# EAGLE design Zigbee Tracker v2 (EAGLE 9.5.0)
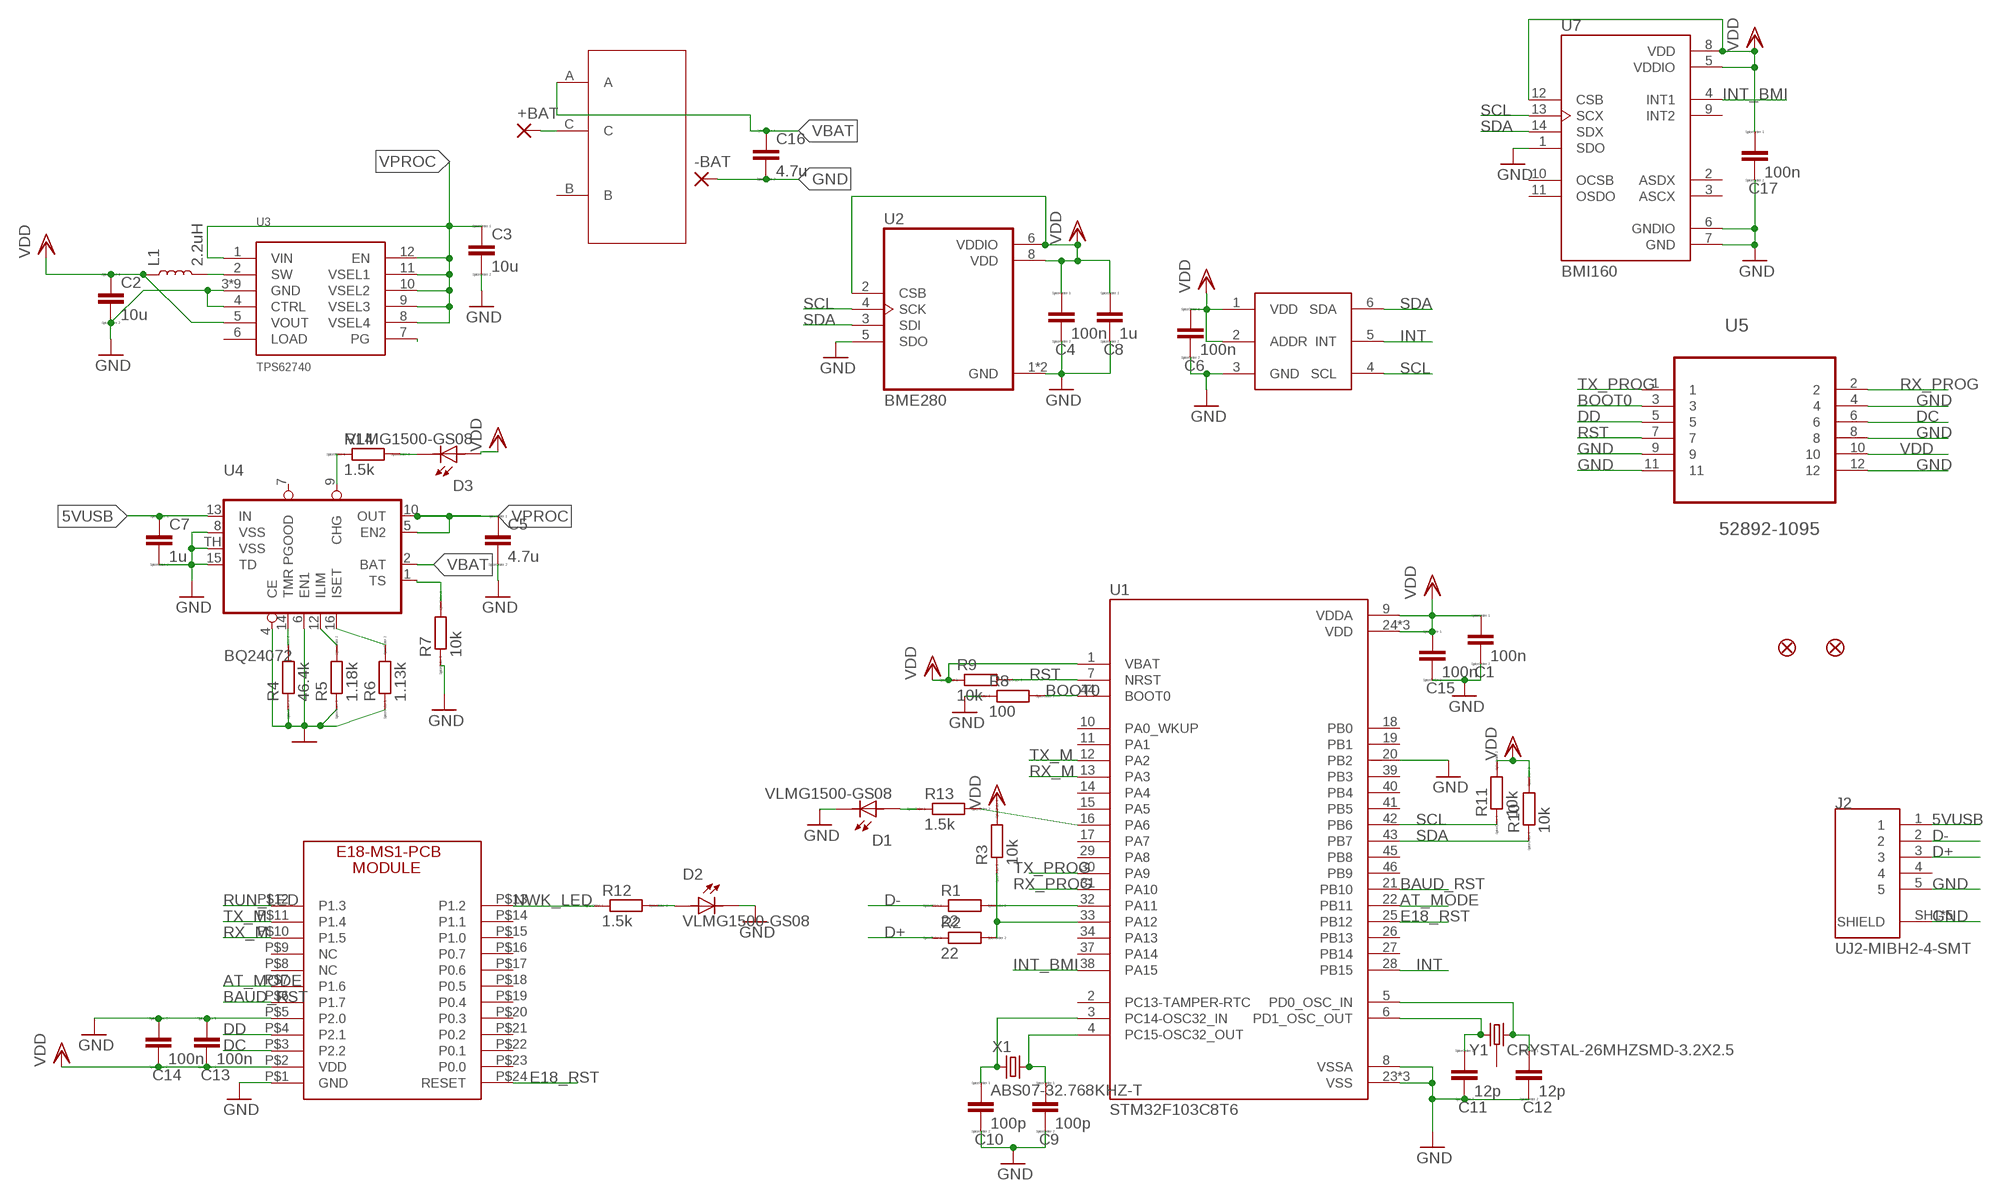
[diagram p0: schematic, sheet 1]

## Parts
+BAT  1,6/0,8  [1,6/0,8]
-BAT  1,6/0,8  [1,6/0,8]
C1  100n  CC0402  [C0402]
C2  10u  CC0402  [C0402]
C3  10u  CC0402  [C0402]
C4  100n  CC0402  [C0402]
C5  4.7u  CC0402  [C0402]
C6  100n  CC0402  [C0402]
C7  1u  CC0402  [C0402]
C8  1u  CC0402  [C0402]
C9  100p  CC0402  [C0402]
C10  100p  CC0402  [C0402]
C11  12p  CC0402  [C0402]
C12  12p  CC0402  [C0402]
C13  100n  CC0402  [C0402]
C14  100n  CC0402  [C0402]
C15  100n  CC0402  [C0402]
C16  4.7u  CC0402  [C0402]
C17  100n  CC0402  [C0402]
D1  VLMG1500-GS08  [LEDC1005X35N]
D2  VLMG1500-GS08  [LEDC1005X35N]
D3  VLMG1500-GS08  [LEDC1005X35N]
FD1  FIDUCIALUFIDUCIAL  [FIDUCIAL-MICRO]
FD2  FIDUCIALUFIDUCIAL  [FIDUCIAL-MICRO]
J2  UJ2-MIBH2-4-SMT  [CUI_UJ2-MIBH2-4-SMT]
L1  2.2uH  INDUCTOR-0805-3.3UH  [0805]
R1  22  RR0402  [R0402]
R2  22  RR0402  [R0402]
R3  10k  RR0402  [R0402]
R4  46.4k  RR0402  [R0402]
R5  1.18k  RR0402  [R0402]
R6  1.13k  RR0402  [R0402]
R7  10k  RR0402  [R0402]
R8  100  RR0402  [R0402]
R9  10k  RR0402  [R0402]
R10  10k  RR0402  [R0402]
R11  10k  RR0402  [R0402]
R12  1.5k  RR0402  [R0402]
R13  1.5k  RR0402  [R0402]
R14  1.5k  RR0402  [R0402]
U1  STM32F103C8T6  [QFP50P900X900X160-48N]
U2  BME280  [PSON65P250X250X100-8N]
U3  TPS62740  [DSS]
U4  BQ24072  [S-PVQFN-N16]
U5  52892-1095  [MOLEX_52892-1095]
U7  BMI160  [PQFN50P300X250X88-14N]
U$1  E18  [E18-MS1-PCB]
U$2  TI-OPT3001  [TI-OPT3001]
U$3  SMDTOGGLESWITCH  [SMDTOGGLESWITCH]
X1  ABS07-32.768KHZ-T  [ABS07-32.768KHZ-T]
Y1  CRYSTAL-26MHZSMD-3.2X2.5  [CRYSTAL-SMD-3.2X2.5MM]

## Nets
5VUSB [PWRINFL]: C7.1 J2.1 U4.13(IN)
AT_MODE: U1.22(PB11) U$1.P$7(P1.6)
BAUD_RST: U1.21(PB10) U$1.P$6(P1.7)
BOOT0: R8.2 U1.44(BOOT0) U5.3
D+: J2.3 R2.1
D-: J2.2 R1.1
DC: U5.6 U$1.P$3(P2.2)
DD: U5.5 U$1.P$4(P2.1)
E18_RST: U1.25(PB12) U$1.P$24(RESET)
GND: -BAT.1(P) C1.2 C2.2 C3.2 C4.2 C5.2 C6.2 C7.2 C8.2 C9.2 C10.2 C11.2 C12.2 C13.1 C14.1 C15.2 C16.2 C17.2 D1.2 D2.2 J2.5 J2.SH1(SHIELD) J2.SH2(SHIELD) J2.SH3(SHIELD) J2.SH4(SHIELD) J2.SH5(SHIELD) R4.1 R5.1 R6.1 R7.1 R8.1 U1.8(VSSA) U1.20(PB2) U1.23(VSS) U1.35(VSS) U1.47(VSS) U2.1(GND) U2.5(SDO) U2.7(GND) U3.3(GND) U3.4(CTRL) U3.13(GND) U3.14(GND) U3.15(GND) U3.16(GND) U3.18(GND) U3.19(GND) U3.20(GND) U3.P$18(GND) U4.4(CE) U4.6(EN1) U4.8(VSS) U4.15(TD) U4.TH(VSS) U5.4 U5.8 U5.9 U5.11 U5.12 U7.1(SDO) U7.6(GNDIO) U7.7(GND) U$1.P$1(GND) U$1.P$5(P2.0) U$2.3(GND)
INT: U1.28(PB15) U$2.5(INT)
INT_BMI: U1.38(PA15) U7.4(INT1)
N$1: R1.2 U1.32(PA11)
N$2: R2.2 R3.1 U1.33(PA12)
N$3: C10.1 U1.3(PC14-OSC32_IN) X1.1
N$4: C9.1 U1.4(PC15-OSC32_OUT) X1.2
N$5: C12.1 U1.5(PD0_OSC_IN) Y1.3
N$6: L1.2 U3.2(SW)
N$7: C11.1 U1.6(PD1_OSC_OUT) Y1.1
N$8: R4.2 U4.14(TMR)
N$9: R5.2 U4.12(ILIM)
N$10: +BAT.1(P) U$3.C
N$11: D2.1 R12.2
N$12: R6.2 U4.16(ISET)
N$13: R13.2 U1.16(PA6)
N$14: D1.1 R13.1
N$15: D3.2 R14.2
N$16: R14.1 U4.9(CHG)
NWK_LED: R12.1 U$1.P$13(P1.2)
PG_SMR: U3.7(PG)
RST: R9.2 U1.7(NRST) U5.7
RUN_LED: U$1.P$12(P1.3)
RX_M: U1.13(PA3) U$1.P$10(P1.5)
RX_PROG: U1.31(PA10) U5.2
SCL: R11.1 U1.42(PB6) U2.4(SCK) U7.13(SCX) U$2.4(SCL)
SDA: R10.1 U1.43(PB7) U2.3(SDI) U7.14(SDX) U$2.6(SDA)
TS: R7.2 U4.1(TS)
TX_M: U1.12(PA2) U$1.P$11(P1.4)
TX_PROG: U1.30(PA9) U5.1
VBAT [PWRINFL]: C16.1 U4.2(BAT) U$3.A
VDD: C1.1 C2.1 C4.1 C6.1 C8.1 C13.2 C14.2 C15.1 C17.1 D3.1 L1.1 R3.2 R9.1 R10.2 R11.2 U1.1(VBAT) U1.9(VDDA) U1.24(VDD) U1.36(VDD) U1.48(VDD) U2.2(CSB) U2.6(VDDIO) U2.8(VDD) U3.5(VOUT) U5.10 U7.5(VDDIO) U7.8(VDD) U7.12(CSB) U$1.P$2(VDD) U$2.1(VDD) U$2.2(ADDR)
VPROC [NCLS3V7]: C3.1 C5.1 U3.1(VIN) U3.8(VSEL4) U3.9(VSEL3) U3.10(VSEL2) U3.11(VSEL1) U3.12(EN) U4.5(EN2) U4.10(OUT)
Unconnected: J2.4 U1.2(PC13-TAMPER-RTC) U1.10(PA0_WKUP) U1.11(PA1) U1.14(PA4) U1.15(PA5) U1.17(PA7) U1.18(PB0) U1.19(PB1) U1.26(PB13) U1.27(PB14) U1.29(PA8) U1.34(PA13) U1.37(PA14) U1.39(PB3) U1.40(PB4) U1.41(PB5) U1.45(PB8) U1.46(PB9) U3.6(LOAD) U4.7(PGOOD) U7.2(ASDX) U7.3(ASCX) U7.9(INT2) U7.10(OCSB) U7.11(OSDO) U$1.P$8(NC) U$1.P$9(NC) U$1.P$14(P1.1) U$1.P$15(P1.0) U$1.P$16(P0.7) U$1.P$17(P0.6) U$1.P$18(P0.5) U$1.P$19(P0.4) U$1.P$20(P0.3) U$1.P$21(P0.2) U$1.P$22(P0.1) U$1.P$23(P0.0) U$3.B Y1.2 Y1.4

## Library data of the parts
+BAT -BAT = wirepad:1,6/0,8: THROUGH-HOLE PAD
C1-C17 = eagle-ltspice:C: CAPACITOR, European symbol; SPICEMODEL: NONE; SPICEPREFIX: C
D1-D3 = VLMG1500-GS08:VLMG1500-GS08: 0402 GREEN 571nm 35MCD 65° Rectangle with Flat Top SMT LED; AVAILABILITY: Unavailable; DESCRIPTION: 0402 GREEN 571nm 35MCD 65° Rectangle with Flat Top SMT LED; MF: Vishay; MP: VLMG1500-GS08; PACKAGE: 0402 Vishay; PRICE: None
FD1 FD2 = SparkFun-Aesthetics:FIDUCIAL: Fiducial Alignment Points Point-of-reference for pick-and-place machines and other optical instruments.
J2 = UJ2-MIBH2-4-SMT:UJ2-MIBH2-4-SMT: Micro B, USB 2.0, 1.8 A, Right Angle, Surface Mount (SMT), USB Receptacle; AVAILABILITY: Unavailable; CUI_PURCHASE_URL: https://www.cui.com/product/interconnect/connectors/usb-connectors/uj2-mibh2-4-smt?utm_source=snapeda.com&utm_medium=referral&utm_campaign=snapedaBOM; DESCRIPTION: Micro B, USB 2.0, 1.8 A, Right Angle, Surface Mount _SMT_, USB Receptacle; MF: CUI Inc.; MP: UJ2-MIBH2-4-SMT; PACKAGE: None; PRICE: None
L1 = SparkFun-Coils:INDUCTOR: Inductors Resist changes in electrical current. Basically a coil of wire. SparkFun Products: SparkFun Load Cell Amplifier - HX711 <https://www.sparkfun.com/products/13879> IOIO-OTG - V2.2 <https://www.sparkfun.com/products/13613>; PROD_ID: NDUC-13076; VALUE: 3.3µH/±20%/450mA
R1-R14 = eagle-ltspice:R: RESISTOR, European symbol; SPICEMODEL: NONE; SPICEPREFIX: R
U1 = STM32F103C8T6:STM32F103C8T6: Mainstream Performance line, ARM Cortex-M3 MCU with 64 Kbytes Flash, 72 MHz CPU, motor control, USB and CAN; AVAILABILITY: Unavailable; DESCRIPTION: Mainstream Performance line, ARM Cortex-M3 MCU with 64 Kbytes Flash, 72 MHz CPU, motor control, USB and CAN; MF: STMicroelectronics; MP: STM32F103C8T6; PACKAGE: LQFP-48 STMicroelectronics; PRICE: None
U2 = BME280:BME280: DIGITAL HUMIDITY, PRESSURE AND TEMPERATURE SENSOR * Digital interface I²C (up to 3.4 MHz) and SPI (3 and 4 wire, up to 10 MHz)* Supply voltage VDD main supply voltage range: 1.71 V to 3.6 V*VDDIO interface voltage range: 1.2 V to 3.6 V Operating range -40…+85 °C, 0…100 % rel. humidity, 300…1100 hPa The library has been designed by Richard Magdycz <https://www.facebook.com/groups/eaglecadsoftUK>; AVAILABILITY: Unavailable; DESCRIPTION: Integrated pressure, humidity and temperature sensor; 8-pin 2.5x2.5x0.93mm LGA; MF: Bosch; MP: BME280; PACKAGE: LGA-8 Bosch; PRICE: None
U3 = TPS62740:TPS62740: TPS62740- BUCK Converter
U4 = Simplex-ICs:BQ24072: TI BQ24072 - Li battery charger and power path management ic
U5 = 52892-1095:52892-1095: CONNECTOR, FPC, ZIF, 0.50MM, 10 WAY; AVAILABILITY: Unavailable; DESCRIPTION: Socket, r/a, Fpc, Zif, Smt, 10way; MF: Molex; MP: 52892-1095; PACKAGE: None; PRICE: None
U7 = BMI160:BMI160: BMI160 2.5 x 3 mm Tiaxial Accelerometer / Gyroscope Inertial Measurement Unit; AVAILABILITY: Unavailable; DESCRIPTION: BMI160 2.5 x 3 mm Tiaxial Accelerometer / Gyroscope Inertial Measurement Unit; MF: Bosch; MP: BMI160; PACKAGE: LGA-14 Bosch; PRICE: None
U$1 = E18:E18
U$2 = FaBo-Mems:TI-OPT3001
U$3 = smdtoggleswitch:SMDTOGGLESWITCH
X1 = Crystals:ABS07-32.768KHZ-T: CRYSTAL 32.7680KHZ 12.5PF SMD Manufacturer's datasheet <https://abracon.com/Resonators/ABS07.pdf>; CREATED_BY: PCBLayout.com; DIGIKEY_PART_NUMBER: 535-9542-2-ND; MANUFACTURER: Abracon LLC; MPN: ABS07-32.768KHZ-T; PACKAGE: SMD-2
Y1 = SparkFun-Clocks:CRYSTAL-26MHZ: 26MHz Crystal w/ Ground Pin Digikey Example <http://www.digikey.com/product-detail/en/epson/TSX-3225%2026.0000MF09Z-AC3/SER3627CT-ND/1802878> Frequency: 26MHz Frequency Stability: ±9ppm Frequency Tolerance: ±10ppm Load Capacitance: 9pF SparkFun Products: SparkFun ESP32 Thing <https://www.sparkfun.com/products/13907> SparkFun ESP8266 Thing Dev Board <https://www.sparkfun.com/products/13711>; PROD_ID: XTAL-12454

## Net classes
1 PWRINFL: width 0.381 mm, drill 0.305 mm, clearance 0.127 mm
2 NCLS3V7: width 0.178 mm, drill 0.178 mm, clearance 0.178 mm

## Board
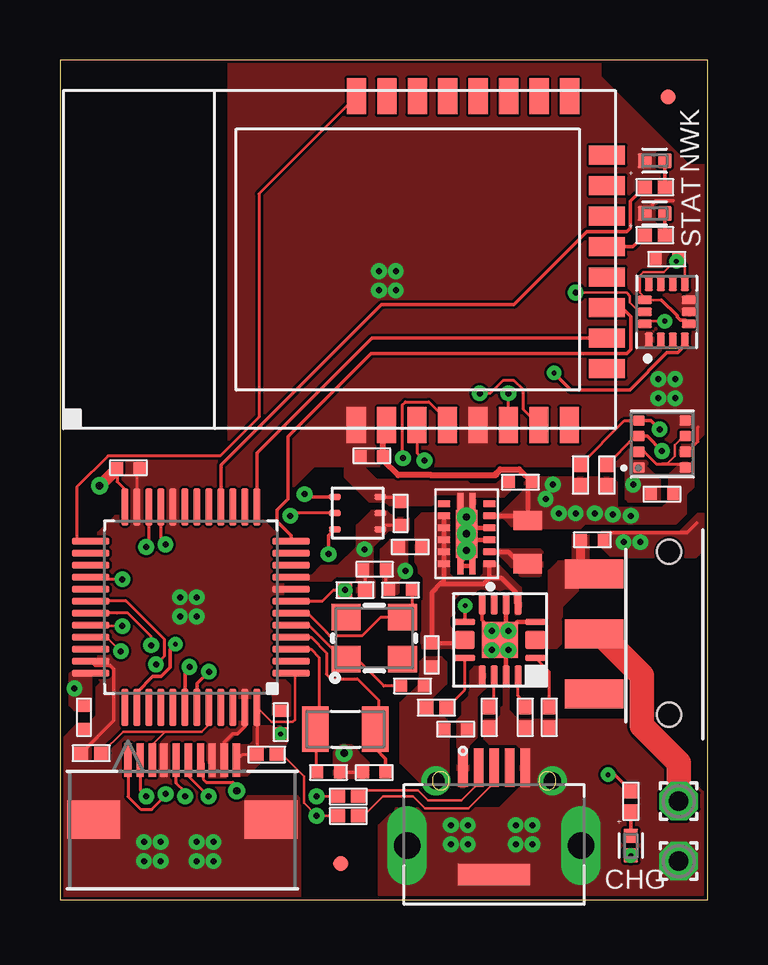
[diagram p1: board, top side]
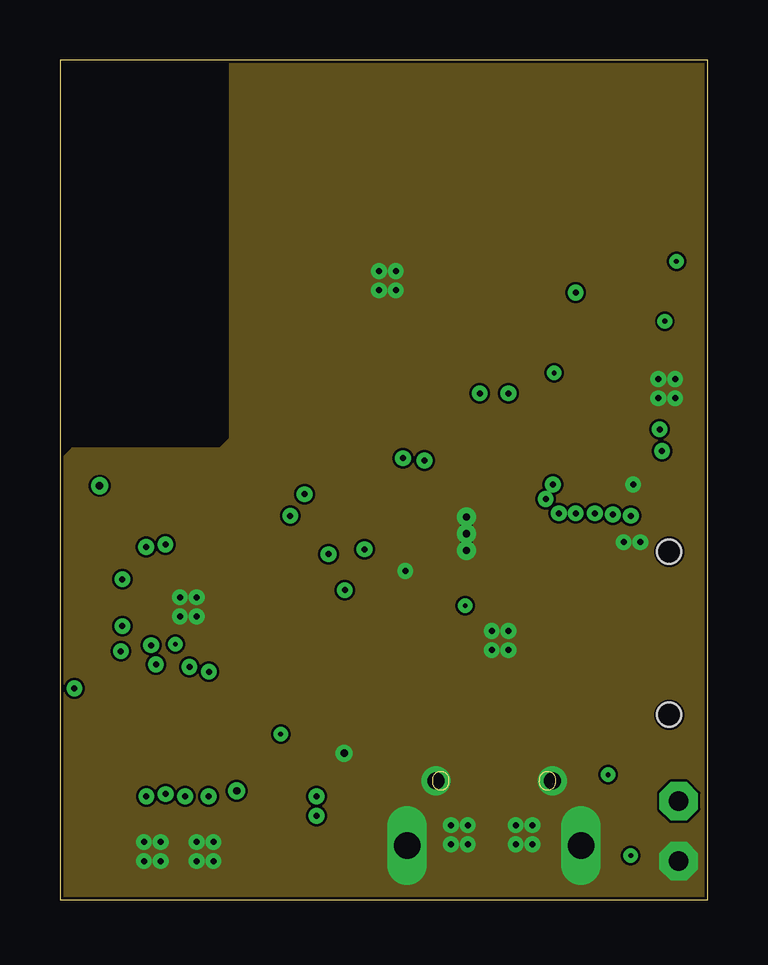
[diagram p2: board, inner layer GND_PL]
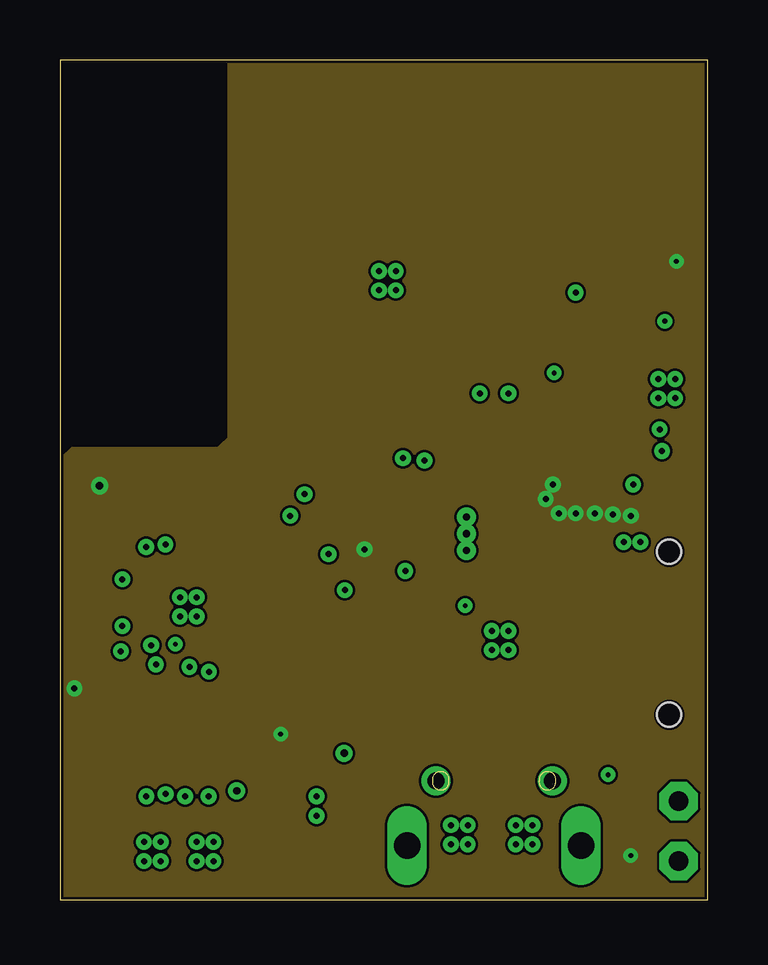
[diagram p3: board, inner layer VDD_PL]
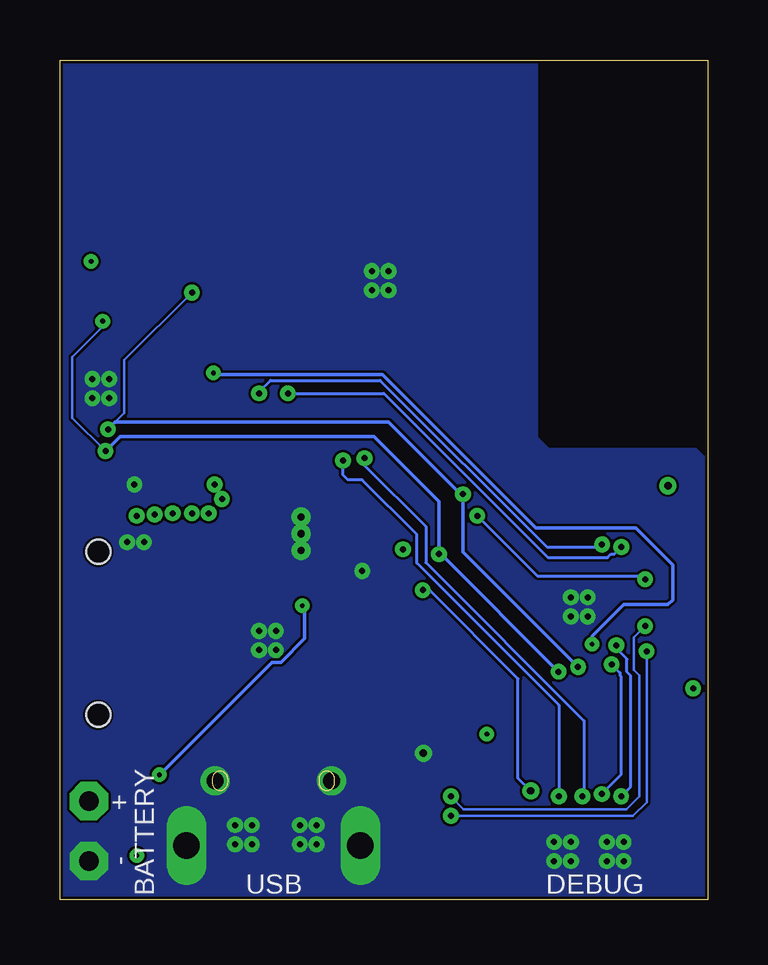
[diagram p4: board, bottom side, seen from below]

Size 27 x 35 mm. Coordinates in mm from the lower left corner, seen from the top.
Outline: 0,0 27,0 27,35 0,35 0,0
Copper layers (1+2*15+16): Top 0.035mm / dielectric 0.2mm / GND_PL 0.0175mm / dielectric 0.465mm / VDD_PL 0.0175mm / dielectric 0.2mm / Bottom 0.035mm
Design rules "default *": minimum track width 3.5mil, minimum drill 0.2mm, track to track 4mil, track to pad 4mil, pad to pad 4mil, via to via 5mil, smd to smd 4mil, copper to edge 5mil, drill to drill 3mil, minimum pad ring 10mil, minimum via ring 8mil, stop-mask expansion 0mil, vias tented up to drill 40mil, thermal gap 0mil
tRestrict: area 22.6,30.8 to 27.1,34.9
bRestrict: area 0,18.4 to 7,35

### Footprints (pad centres in the part's own frame; a part is rotated, then mirrored left to right if it is on the bottom)
1,6/0,8 = drill 0.813 pad 1.6 octagon: 1 0,0
C0402 = smd 0.5 x 0.5: 1 -0.475,0; 2 0.475,0
LEDC1005X35N = smd 0.59 x 0.61: 1 -0.415,0; 2 0.415,0
FIDUCIAL-MICRO = smd 0.635 x 0.635: 1 0,0
CUI_UJ2-MIBH2-4-SMT = smd 1.6 x 0.4: 1 1.1,0; 2 1.1,-0.65; 3 1.1,-1.3; 4 1.1,-1.95; 5 1.1,-2.6 | drill 1.1 pad 1.2 long: SH1 -2.15,2.325; SH4 -2.15,-4.925 | drill 0.7 pad 1: SH2 0.55,1.125; SH5 0.55,-3.725 | smd 0.9 x 3: SH3 -3.35,-1.3
0805 = smd 0.8 x 1.2: 1 -0.9,0; 2 0.9,0
R0402 = smd 0.6 x 0.55: 1 -0.425,0; 2 0.425,0
QFP50P900X900X160-48N = smd 1.56 x 0.28: 1 -4.18,2.75; 2 -4.18,2.25; 3 -4.18,1.75; 4 -4.18,1.25; 5 -4.18,0.75; 6 -4.18,0.25; 7 -4.18,-0.25; 8 -4.18,-0.75; 9 -4.18,-1.25; 10 -4.18,-1.75; 11 -4.18,-2.25; 12 -4.18,-2.75; 25 4.18,-2.75; 26 4.18,-2.25; 27 4.18,-1.75; 28 4.18,-1.25; 29 4.18,-0.75; 30 4.18,-0.25; 31 4.18,0.25; 32 4.18,0.75; 33 4.18,1.25; 34 4.18,1.75; 35 4.18,2.25; 36 4.18,2.75 | smd 0.28 x 1.56: 13 -2.75,-4.18; 14 -2.25,-4.18; 15 -1.75,-4.18; 16 -1.25,-4.18; 17 -0.75,-4.18; 18 -0.25,-4.18; 19 0.25,-4.18; 20 0.75,-4.18; 21 1.25,-4.18; 22 1.75,-4.18; 23 2.25,-4.18; 24 2.75,-4.18; 37 2.75,4.18; 38 2.25,4.18; 39 1.75,4.18; 40 1.25,4.18; 41 0.75,4.18; 42 0.25,4.18; 43 -0.25,4.18; 44 -0.75,4.18; 45 -1.25,4.18; 46 -1.75,4.18; 47 -2.25,4.18; 48 -2.75,4.18
PSON65P250X250X100-8N = smd 0.49 x 0.45: 1 0.97,0.975; 2 0.97,0.325; 3 0.97,-0.325; 4 0.97,-0.975; 5 -0.97,-0.975; 6 -0.97,-0.325; 7 -0.97,0.325; 8 -0.97,0.975
DSS = smd 0.28 x 0.5: 1 0,0; 2 0.5,0; 3 1,0; 4 1.5,0; 5 2,0; 6 2.5,0; 7 2.5,1.9; 8 2,1.9; 9 1.5,1.9; 10 1,1.9; 11 0.5,1.9; 12 0,1.9 | smd 0.7 x 0.25: 13 2.6,0.7; 14 2.6,1.2; 15 -0.1,0.7; 16 -0.1,1.2 | drill 0.3 pad 0.406: 18 0.55,0.95; 20 1.95,0.95; P$18 1.25,0.95 | smd 2 x 0.9: 19 1.25,0.95
S-PVQFN-N16 = smd 0.85 x 0.28: 1 -0.725,2.225; 4 -0.725,0.725; 9 2.225,0.725; 12 2.225,2.225 | smd 0.85 x 0.78: 2 -0.725,1.475; 10 2.225,1.475 | smd 0.28 x 0.85: 5 0,0; 6 0.5,0; 7 1,0; 8 1.5,0; 13 1.5,2.95; 14 1,2.95; 15 0.5,2.95; 16 0,2.95 | smd 1.5 x 1.5: TH 0.75,1.475
MOLEX_52892-1095 = smd 0.305 x 1.397: 1 2.261,2.896; 2 1.753,2.896; 3 1.245,2.896; 4 0.762,2.896; 5 0.254,2.896; 6 -0.254,2.896; 7 -0.762,2.896; 8 -1.245,2.896; 9 -1.753,2.896; 10 -2.261,2.896 | smd 2.21 x 1.6: 11 -3.702,5.359; 12 3.702,5.359
PQFN50P300X250X88-14N = smd 0.59 x 0.35: 1 -1.165,0.75; 2 -1.165,0.25; 3 -1.165,-0.25; 4 -1.165,-0.75; 8 1.165,-0.75; 9 1.165,-0.25; 10 1.165,0.25; 11 1.165,0.75 | smd 0.35 x 0.59: 5 -0.5,-0.915; 6 0,-0.915; 7 0.5,-0.915; 12 0.5,0.915; 13 0,0.915; 14 -0.5,0.915
E18-MS1-PCB = smd 1.5 x 0.8: P$1 13.75,12.2; P$2 13.75,13.47; P$3 13.75,14.74; P$4 13.75,16.01; P$5 13.75,17.28; P$6 13.75,18.55; P$7 13.75,19.82; P$8 13.75,21.09; P$17 0.05,21.1; P$18 0.05,19.83; P$19 0.05,18.56; P$20 0.05,17.29; P$21 0.05,16.02; P$22 0.05,14.75; P$23 0.05,13.48; P$24 0.05,12.21 | smd 0.8 x 1.5: P$9 11.39,22.66; P$10 10.12,22.66; P$11 8.85,22.66; P$12 7.58,22.66; P$13 6.31,22.66; P$14 5.04,22.66; P$15 3.77,22.66; P$16 2.5,22.66
TI-OPT3001 = smd 0.5 x 0.25: 1 -0.95,0.675; 2 -0.95,0; 3 -0.95,-0.675; 4 0.95,-0.675; 5 0.95,0; 6 0.95,0.675
SMDTOGGLESWITCH = smd 2.45 x 1.2: A 1.37,3.77; B 1.37,-1.23; C 1.37,1.27 | hole 1: 4.5,4.7; 4.5,-2.1
ABS07-32.768KHZ-T = smd 1.1 x 1.9: 1 -1.25,0; 2 1.25,0
CRYSTAL-SMD-3.2X2.5MM = smd 1.2 x 1.1: 1 -1.175,-0.875; 2 1.175,-0.875; 3 1.175,0.875; 4 -1.175,0.875

### Placement (x,y rotation side)
+BAT  25.8,4.1 0 top
-BAT  25.8,1.6 0 top
C1  13.12,13.77 0 top
C2  19.2,17.4 180 top
C3  14.6,14.7 180 top
C4  13,18.5 180 top
C5  15.5,10.2 270 top
C6  14.2,16.1 90 top
C7  16.5,7.1 180 top
C8  25.1,16.9 180 top
C9  13.1,5.3 180 top
C10  11.2,5.3 0 top
C11  14.2,12.9 180 top
C12  14.7,8.9 0 top
C13  9.2,7.4 270 top
C14  1,7.6 90 top
C15  2.85,18 0 top
C16  22.2,15 0 top
C17  25.3,26.7 180 top
D1  24.8,30.8 180 top
D2  24.8,28.6 180 top
D3  23.8,2.25 90 top
FD1  25.35,33.45 0 top
FD2  11.7,1.5 0 top
J2  16.8,4.4 90 top
L1  19.5,14.9 270 top
R1  12.02,4.3 180 top
R2  12.02,3.49 180 top
R3  8.62,6.05 180 top
R4  17.9,7.6 90 top
R5  15.7,8 0 top
R6  19.4,7.6 90 top
R7  20.4,7.6 90 top
R8  1.3,6.1 0 top
R9  12.3,12.9 180 top
R10  22.8,17.7 270 top
R11  21.7,17.7 270 top
R12  24.8,27.7 0 top
R13  24.8,29.7 180 top
R14  23.8,4.1 270 top
U1  5.46,12.19 180 top
U2  25.11,18.99 180 top
U3  17.9,14 90 top
U4  19.1,12.3 180 top
U5  5.1,8.7 180 top
U7  25.3,24.5 90 top
U$1  0.15,33.53 270 top
U$2  12.41,16.11 180 top
U$3  20.9,9.8 0 top
X1  11.9,7.1 0 top
Y1  13.1,10.9 180 top

### Tracks (layer width: path | path; a pad name or v marks a point on that pad's centre or on a via)
5VUSB
  Top 0.381: C7.1 16.9,7.03
  pour Top: 16.6,4.7 16.6,7.5 16.8,7.7 16.8,8.2 17.1,8.5 17.1,9.5 17.3,9.7 17.7,9.7 17.7,8.8 17.35,8.45 17.35,6.75 17,6.4 17,4.7
AT_MODE  (via drill 0.25)
  Top 0.127: U$1.P$7 19.32,20.43 19.32,21.25 18.93,21.64 18.48,21.64 17.93,21.1 v17.5,21.1 | v3.59,14.7 3.69,14.8 3.69,16.35 U1.22
  Bottom 0.127: v17.5,21.1 13.5,21.1 6.66,14.26 4.17,14.26 4.03,14.4 3.89,14.4 v3.59,14.7
BAUD_RST  (via drill 0.25)
  Top 0.127: U$1.P$6 v18.7,21.1 | v4.4,14.8 4.21,14.99 U1.21
  Bottom 0.127: v4.4,14.8 4.5,14.7 6.71,14.7 13.65,21.64 18.23,21.64 18.7,21.17 v18.7,21.1
BOOT0
  Top 0.102: 3.9,5.85 U5.3 3.88,5.83 3.88,6.49 4.39,7 | 2,6.1 R8.2 2.62,7 4.39,7 | 4.39,7 5.9,7 6.21,7.31 U1.44
D+
  Top 0.102: R2.1 12.54,3.4 12.57,3.4 13.47,4.3 14.73,4.3 15.23,3.8 17.04,3.8 18.02,4.78
  Top 0.152: J2.3 18.1,4.86 18.02,4.78
D-
  Top 0.102: 17.5,4.9 17.4,4.8 16.74,4.14 15.34,4.14 14.93,4.56 12.5,4.56 12.45,4.5 R1.1
  Top 0.152: J2.2 17.45,4.85 17.4,4.8
DC  (via drill 0.25)
  Top 0.127: U$1.P$3 14.89,18.61 v15.2,18.3 | v6.2,4.3 v6.2,4.31 5.35,5.16 U5.6
  Bottom 0.127: v6.2,4.3 6.2,8.11 12.12,14.03 12.12,15.22 14.4,17.5 15,17.5 15.2,17.7 v15.2,18.3
DD  (via drill 0.25)
  Top 0.127: v5.22,4.3 5.22,4.48 4.85,4.85 U5.5 | v14.3,18.4 14.27,18.43 14.27,20.62 14.4,20.75 15.38,20.75 16.16,19.96 U$1.P$4
  Bottom 0.127: v14.3,18.4 14.3,18.1 11.74,15.54 11.74,14.04 5.16,7.46 5.16,4.3 v5.22,4.3
E18_RST
  Top 0.127: U$1.P$24 8.3,29.42 8.3,20.12 6.68,18.5 2,18.5 0.7,17.2 0.7,15 0.76,14.94 U1.25
GND  (via drill 0.25, 0.3)
  Top 0.102: U3.16 16.7,14 | 16.7,14 16.7,14.3 16.75,14.35 | U3.P$18 17.02,15.18 | U3.P$18 16.95,15.8 17.02,15.88 | U3.P$18 16.95,14.25 16.7,14
  Top 0.127: U1.23 3.21,17.89 C15.2 | C11.2 13.6,13.03 C1.2 | U$2.3 13.99,16.79 C6.2 | U2.7 26.09,18.67 26.18,18.67 26.6,19.09 26.6,19.7 | 16.75,14.35 U3.18
  Top 0.15: U4.8 17.6,11.65 18,11.25 v18,11.2 18,11.18 U4.TH | C10.2 C9.2 | 25.58,29.13 24.85,29.13 24.69,28.97 24.69,28.91 D2.2 | U1.35 1.46,9.76 2.09,9.76 2.24,9.61 2.24,7.46 R8.1
  Top 0.152: U5.9 6.85,6.55 7.2,6.9 7.4,6.9 7.71,7.21 U1.47 | U5.4 4.26,5.88 4.26,5.91 | U2.7 26.19,18.67 | 26.55,15.7 26.15,15.3 22.98,15.3 C16.2
  Top 0.178: U4.6 18.6,11.3 18.68,11.22 | 18.68,11.22 v18.7,11.2 19.07,11.57 U4.4 | U4.15 18.6,11.15 18.68,11.22 | U3.4 17.4,15.5 17.02,15.88 U3.20 | U3.3 17.2,15 17.02,15.18 | U3.16 U3.15
  other vias: 18.7,10.4 18,10.4 5.7,11.8 5,11.8 5.7,12.6 5,12.6 23.9,17.3 24.2,14.9 23.5,14.9 17,2.3 16.3,2.3 17,3.1 16.3,3.1 19.7,2.3 19,2.3 19.7,3.1 19,3.1 6.4,1.6 5.7,1.6 6.4,2.4 5.7,2.4 4.2,1.6 3.5,1.6 4.2,2.4 3.5,2.4 11.85,6.1 14.4,13.7 25.65,20.9 24.95,20.9 25.65,21.7 24.95,21.7 14,25.4 13.3,25.4 14,26.2 13.3,26.2
  pour GND_PL: 27.1,0 0,0 0,18.3 0.5,18.8 6.65,18.8 7.1,19.25 7.1,35 27.2,35 27.2,0.1
  pour Top: 16.6,16.3 16.6,16.9 15.6,16.9 15.5,16.8 15.5,16.45 13.75,16.45 13.6,16.6 12.9,16.6 11.9,17.6 11.9,20.5 12.7,20.5 12.7,18 13.2,17.5 16.9,17.5 17.3,17.1 17.3,16.3
  pour Top: 16.9,17.3 18.2,17.3 18.5,17.6 18.9,17.6 18.9,17.2 18.5,16.8 17.1,16.8 16.9,17
  pour Top: 13.5,12.7 13.5,13.4 13.4,13.5 13.4,14.6 13.8,15 14.45,15 14.45,13.65 14.1,13.3 14.1,12.8 14,12.7
  pour Top: 1.6,9.2 1.6,15.3 2.3,16 8.3,16 9.3,15 9.3,9.5 8.2,8.4 2.4,8.4
  pour Top: 16.2,4.9 16.2,7.4 16,7.6 15.7,7.6 15.5,7.8 15.5,8.4 16.1,9 16.1,9.9 15.9,10.1 15.2,10.1 15,9.9 15,9 14.2,8.2 14.2,5.7 15.2,4.7 16,4.7
  pour Top: 19.2,4.7 19.2,6.3 19,6.5 17.9,6.5 17.7,6.7 17.7,7.5 18.2,7.5 18.4,7.7 18.4,8 18.5,8.1 18.5,9.7 18.7,9.7 18.7,7.9 19.1,7.5 23.8,7.5 26.8,4.5 26.8,0.2 13.3,0.2 13.3,3.1 14,3.8 18.3,3.8
  pour Top: 25,16.6 23.7,16.6 23.6,16.7 23.6,18.1 23.7,18.2 24.3,18.2 25,17.5
  pour Top: 0,0.1 0,6.6 0.7,7.3 1.3,7.3 1.4,7.2 2,7.2 2.2,7.4 7.8,7.4 6.9,6.5 6.9,5.1 7.7,4.3 9.9,4.3 10,4.2 10,0.1
  pour Top: 22.5,14.8 22.5,15.2 22.6,15.3 25.85,15.3 26.6,16.05 26.9,16.05 26.9,14.7 26.5,14.3 23,14.3
  pour Top: 8.9,7.7 8.9,8.5 8.5,8.9 8.9,9.3 9.2,9.3 9.6,8.9 9.6,7.7
  pour Top: 1.8,15.3 0.5,15.3 0.2,15.6 0.2,17.9 1.05,18.75 6.65,18.75 7.05,19.15 7.05,34.9 27.4,34.9 27.4,20 26,18.6 24.9,18.6 24.4,18.1 10.6,18.1 8.1,15.6 2.1,15.6
  pour Top: 11.45,5.1 11.45,6.15 11.7,6.4 12.15,6.4 12.85,5.7 12.85,5.1
  pour Top: 1.3,7.1 1.3,7.4 1.55,7.65 1.55,8.85 1.75,9.05 2.2,9.05 2.3,8.95 2.45,8.8 2.45,7.35 2.2,7.1
  pour Bottom: -0.35,35.35 27.15,35.35 27.15,-0.3 -0.6,-0.3 -0.6,35.35
INT  (via drill 0.25)
  Top 0.127: U$2.5 9.81,16.11 9.7,16 v9.6,16 | v2.6,13.35 1.37,13.35 U1.28
  Bottom 0.127: v9.6,16 7.1,13.5 2.75,13.5 v2.6,13.35
INT_BMI  (via drill 0.2)
  Top 0.15: U7.4 26.05,23.09 25.76,22.8 25.3,22.8 23.75,21.25 21.3,21.25 v20.6,21.95 | v4.81,10.65 4.58,10.42 4.58,9.67 4.21,9.29 3.87,9.29 3.21,8.64 U1.38
  Bottom 0.15: v20.6,21.95 20.53,21.88 13.55,21.88 7.17,15.5 3,15.5 1.45,13.95 1.45,12.5 1.65,12.3 3.5,12.3 4.81,10.99 v4.81,10.65
N$1  (via drill 0.25)
  Top 0.102: R1.2 v10.7,4.3 | v2.6,11.4 1.32,11.4 U1.32
  Bottom 0.102: v2.6,11.4 3.07,10.93 3.07,9.58 2.85,9.35 2.85,4.3 3.38,3.77 10.17,3.77 v10.7,4.3
N$2  (via drill 0.25)
  Top 0.102: R2.2 v10.7,3.49 10.17,4.02 10.17,5.13 9.25,6.05 R3.1 | v2.54,10.35 1.89,11 1.34,11 U1.33
  Bottom 0.102: v10.7,3.49 3.11,3.49 2.54,4.06 v2.54,10.35
N$3
  Top 0.127: U1.3 10.46,10.44 10.8,10.1 10.8,7.7 10.65,7.55 10.65,7.2 | 10.65,7.2 X1.1 | C10.1 10.7,5.33 10.7,7.15 10.65,7.2
N$4
  Top 0.127: U1.4 10.46,10.94 11.11,10.29 11.11,9.39 11.29,9.2 12.4,9.2 13.3,8.3 13.3,7.25 X1.2 | 13.6,6.6 13.57,6.58
  Top 0.15: C9.1 13.57,5.88 13.15,6.3 X1.2 13.6,6.65 13.6,6.6 | 13.57,6.67 13.57,6.58
N$5
  Top 0.127: U1.5 10.36,11.44 11.78,10.03 Y1.3 12.38,10.03 13.5,8.9 C12.1
N$6
  Top 0.178: L1.2 19.2,14 18.7,14.5 U3.2
  pour Top: 17.7,14.4 17.7,14.6 20,14.6 20.1,14.5 20.1,13.6 20,13.5 19.2,13.5 18.3,14.4
N$7
  Top 0.127: U1.6 10.32,11.94 11.11,11.15 11.11,11.14 11.24,11.01 12.61,11.01 13.38,11.78 Y1.1 14.68,12.18 C11.1
N$8
  Top 0.127: R4.2 18.1,8.22 U4.14
N$9
  Top 0.127: R5.2 16.88,8.75 U4.12
N$10
  Top 1.016: U$3.C 22.53,11.07 24.27,9.33 24.27,7.23 25.8,5.7 +BAT.1
N$11
  Top 0.15: R12.2 25.21,27.71 D2.1
N$12
  Top 0.127: R6.2 19.4,8.2 19.1,8.5 U4.16
N$13
  Top 0.15: R13.2 23.79,29.11 23.79,28 23.64,27.85 21.97,27.85 18.92,24.8 13.4,24.8 6.71,18.11 U1.16
N$14
  Top 0.15: R13.1 25.21,29.71 D1.1
N$15
  Top 0.152: D3.2 R14.2
N$16  (via drill 0.2)
  Top 0.152: R14.1 23.12,5.2 v22.85,5.2 | v16.9,12.25 16.88,12.22 U4.9
  Bottom 0.152: v22.85,5.2 18.16,9.89 17.79,9.89 16.8,10.88 16.8,12.15 v16.9,12.25
NWK_LED
  Top 0.15: U$1.P$13 23.89,27.22 R12.1
RST  (via drill 0.25, 0.3)
  Top 0.127: U1.7 10.94,12.44 11.4,12.9 R9.2 | U5.7 5.98,5.69 5.98,5.02 6.1,4.89 7.2,4.89 7.37,4.72 v7.37,4.53
  Bottom 0.127: v7.37,4.53 7.9,5.06 7.9,9.2 11.6,12.9 R9.2
  other vias: 11.88,12.9
RX_M
  Top 0.15: U1.13 8.21,18.61 13.01,23.41 U$1.P$10
RX_PROG  (via drill 0.25)
  Top 0.127: U5.2 3.35,4.55 v3.6,4.3 | v3.8,10.6 3.8,10.97 2.83,11.94 2.38,11.94 2.37,11.94 U1.31
  Bottom 0.127: v3.6,4.3 3.2,4.7 3.2,9.33 3.36,9.49 3.36,10.03 3.8,10.47 v3.8,10.6
SCL  (via drill 0.25)
  Top 0.102: U7.13 24.26,24.62 24.03,24.62 23.76,24.89 23.76,25.16 23.63,25.3 v21.5,25.3
  Top 0.127: R11.1 23.54,19.96 U2.4
  Top 0.15: U1.42 5.21,9.41 5.4,9.6 v5.4,9.7 | v10.2,16.9 10.31,16.79 U$2.4 | v25,19.6 24.64,19.96 U2.4
  Bottom 0.102: v21.5,25.3 24.32,22.48 24.32,20.28 v25,19.6
  Bottom 0.15: v5.4,9.7 10.2,14.5 v10.2,16.9 10.3,16.9 13.3,19.9 24.7,19.9 v25,19.6
SDA  (via drill 0.2, 0.25)
  Top 0.102: U7.14 24.5,24.11 v25.22,24.11
  Top 0.127: R10.1 23.99,19.32 U2.3
  Top 0.15: U1.43 5.71,9 v6.21,9.5 | v11.2,14.4 11.2,15.18 U$2.6 | v25.1,18.7 24.48,19.32 U2.3
  Bottom 0.102: v25.22,24.11 25.22,23.88 26.48,22.62 26.48,20.08 v25.1,18.7
  Bottom 0.15: v6.21,9.5 11.11,14.4 v11.2,14.4 11.2,16.6 13.9,19.3 24.5,19.3 v25.1,18.7
TS
  Top 0.127: U4.1 20.4,9.5 R7.2
TX_M
  Top 0.15: U$1.P$11 23.42,24.68 23.8,24.3 23.8,22.93 23.64,22.77 12.97,22.77 9.51,19.31 9.51,16.7 9.04,16.23 9.04,15.77 9.64,15.17 U1.12
TX_PROG  (via drill 0.25)
  Top 0.127: U5.1 2.84,4.29 3.38,3.76 3.83,3.76 4.41,4.34 v4.41,4.4 | v4,9.8 4.34,10.14 4.34,10.86 2.76,12.44 U1.30
  Bottom 0.127: v4.41,4.4 3.6,5.21 3.6,9.3 3.65,9.35 3.65,9.45 v4,9.8
VBAT
  Top 0.381: U$3.A 21.73,14.12 C16.1
  pour Top: 19.5,10.5 19.5,11.1 20.2,11.1 20.4,11.3 20.4,13.7 20.8,14.1 21.3,14.1 21.4,14.2 21.4,15.2 22,15.2 22,13.9 21.9,13.8 21.9,13.2 20.9,12.2 20.9,10.7 20.7,10.5
VDD  (via drill 0.2, 0.25, 0.3)
  Top 0.102: U2.6 26.01,19.32 25.63,18.94 25.63,18.48 25.32,18.17 25.11,18.17 25.1,18.16 | C17.1 25.71,26.7 25.18,26.16 24.32,26.16 24.17,26.02 24.17,25.31 24.39,25.1 U7.12 25.08,25 | U7.8 26.05,26.43 C17.1 | U7.5 26.18,24.03 26.09,24.12 25.96,24.12 | U1.48 8.82,7.4 9.7,7.4 9.8,7.5 9.8,9.28 U1.1 | C17.1 25.77,26.68 v25.7,26.6
  Top 0.127: U5.10 7.61,6.05 R3.2 8.21,6.07 U1.48 | C15.1 2.38,17.43 2.71,17.09 U1.24 | C1.1 12.72,13.69 R9.1 | U$2.1 13.55,15.62 C6.1 | U2.2 24.37,18.66 24.88,18.16 25.1,18.16 25.94,18.16 U2.8
  Top 0.15: 26.18,24.03 26.07,24.15 25.87,24.15 25.74,24.28 25.74,24.34 25.08,25
  Top 0.178: U3.5 19.3,16 L1.1 19.5,17.23 C2.1
  Top 0.254: C2.1 19.15,17.93 18.36,17.93 18.2,17.77 18.2,17.7 15.46,17.7 15.45,17.69 14.11,17.69 13.47,18.32 C4.1 13.47,19.64 U$1.P$2
  Top 0.508: v1.65,17.25 2.38,17.98 C15.1
  other vias: 12.7,14.6 21.5,16.1 20.8,16.1 20.55,17.3 22.3,16.1 0.6,8.8 9.2,6.9 20.25,16.7 23.05,16.05 23.8,16 23.8,1.83
  pour Top: 17.7,15.9 17.7,16.1 18.4,16.1 19.4,17.1 19.4,17.4 19.6,17.6 23,17.6 23.2,17.4 23.2,16.05 22.95,15.8 22,15.8 21.7,15.5 18.9,15.5 18.5,15.9
  pour Top: 12.5,12.6 12.4,12.7 12.4,13.5 11.5,13.5 11.3,13.3 9.9,13.3 9.9,13.5 10.5,13.5 10.9,13.9 11.6,13.9 12.4,14.7 12.4,15.6 13,16.2 13.6,16.2 13.9,15.9 14.5,15.9 14.5,15.4 13.7,15.4 13,14.7 13,13.4 13.1,13.3 13.1,12.6
  pour Top: 21,16.3 21.6,15.7 25.7,15.7 26.1,16.1 26.1,16.9 26.4,17.2 26.4,18.2 25.9,18.2 25.4,17.7 25.4,16.6 25.1,16.3
  pour Top: 1.3,7.9 0.6,7.9 0.4,8.1 0.4,9.4 0.5,9.5 1.3,9.5
  pour Top: 7.3,5.2 7.3,6.2 7.5,6.4 7.9,6.4 8.1,6.6 8.1,7.2 9.2,7.2 9.4,7 9.4,6.5 8.7,6.5 8.4,6.2 8.4,5.8 7.8,5.2
  pour VDD_PL: 7.05,34.9 7.05,19.25 6.7,18.9 6.6,18.8 0.5,18.8 0.1,18.4 0.1,18.25 0.1,0.15 0.2,0.05 26.95,0.05 27.05,0.15 27.05,34.95 7.1,34.95
VPROC
  Top 0.178: U4.10 16.73,10.68 C5.1 15.5,12.8 15.85,13.15 | 15.85,13.15 16,13.3 U3.12 U3.11 U3.10 U3.9 U3.8 | 15.85,13.15 17.65,13.15 17.9,13.4 | 17.9,13.4 U3.1 | U4.5 19.01,12.39 19.01,12.79 18.4,13.4 17.9,13.4
  pour Top: 17.2,10.5 15.1,10.5 15.1,12.4 15.2,12.5 15.2,13.4 14.85,13.75 14.85,15.85 15.1,16.1 16.2,16.1 16.2,13.6 16.5,13.3 17.4,13.3 17.7,13.6 17.7,14.05 18.15,14.05 19.2,13 19.2,11.9 19,11.9 19,12.7 18.8,12.9 17.5,12.9 16.3,11.7 16.3,11.3 16.5,11.1 17.2,11.1

### Text on the board
tPlace: NWK | STAT | CHG
bPlace: BATTERY | + | - | DEBUG | USB